# EAGLE design Apollo v1 (EAGLE 7.4.0)
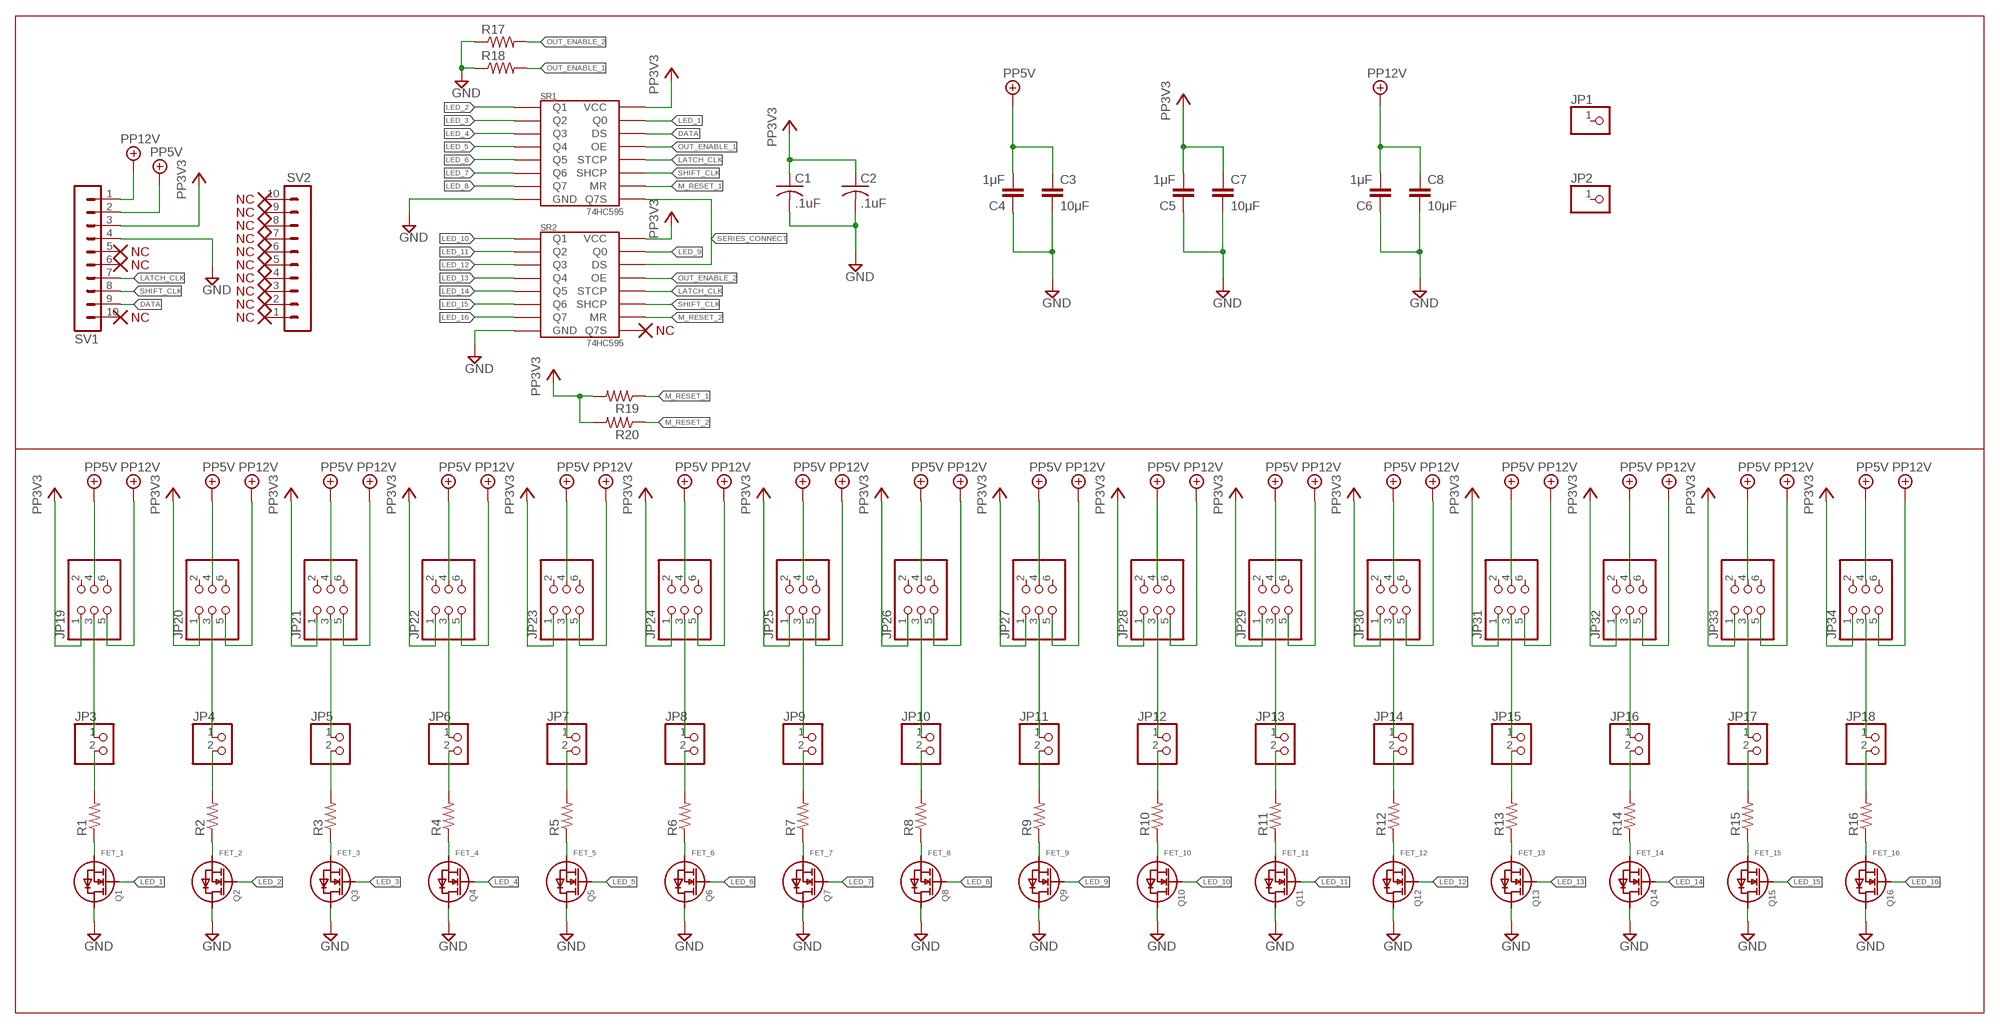
[diagram p0: schematic, sheet 1]

## Parts
C1  .1uF  C-USC0603  [C0603]
C2  .1uF  C-USC0603  [C0603]
C3  10μF  C-EUC1206  [C1206]
C4  1μF  C-EUC0603  [C0603]
C5  1μF  C-EUC0603  [C0603]
C6  1μF  C-EUC0603  [C0603]
C7  10μF  C-EUC1206  [C1206]
C8  10μF  C-EUC1206  [C1206]
JP1  PINHD-1X1  [1X01]
JP2  PINHD-1X1  [1X01]
JP3  PINHD-1X2  [1X02]
JP4  PINHD-1X2  [1X02]
JP5  PINHD-1X2  [1X02]
JP6  PINHD-1X2  [1X02]
JP7  PINHD-1X2  [1X02]
JP8  PINHD-1X2  [1X02]
JP9  PINHD-1X2  [1X02]
JP10  PINHD-1X2  [1X02]
JP11  PINHD-1X2  [1X02]
JP12  PINHD-1X2  [1X02]
JP13  PINHD-1X2  [1X02]
JP14  PINHD-1X2  [1X02]
JP15  PINHD-1X2  [1X02]
JP16  PINHD-1X2  [1X02]
JP17  PINHD-1X2  [1X02]
JP18  PINHD-1X2  [1X02]
JP19  PINHD-2X3  [2X03]
JP20  PINHD-2X3  [2X03]
JP21  PINHD-2X3  [2X03]
JP22  PINHD-2X3  [2X03]
JP23  PINHD-2X3  [2X03]
JP24  PINHD-2X3  [2X03]
JP25  PINHD-2X3  [2X03]
JP26  PINHD-2X3  [2X03]
JP27  PINHD-2X3  [2X03]
JP28  PINHD-2X3  [2X03]
JP29  PINHD-2X3  [2X03]
JP30  PINHD-2X3  [2X03]
JP31  PINHD-2X3  [2X03]
JP32  PINHD-2X3  [2X03]
JP33  PINHD-2X3  [2X03]
JP34  PINHD-2X3  [2X03]
Q1  DMN6140L-7  [SOT-23-3]
Q2  DMN6140L-7  [SOT-23-3]
Q3  DMN6140L-7  [SOT-23-3]
Q4  DMN6140L-7  [SOT-23-3]
Q5  DMN6140L-7  [SOT-23-3]
Q6  DMN6140L-7  [SOT-23-3]
Q7  DMN6140L-7  [SOT-23-3]
Q8  DMN6140L-7  [SOT-23-3]
Q9  DMN6140L-7  [SOT-23-3]
Q10  DMN6140L-7  [SOT-23-3]
Q11  DMN6140L-7  [SOT-23-3]
Q12  DMN6140L-7  [SOT-23-3]
Q13  DMN6140L-7  [SOT-23-3]
Q14  DMN6140L-7  [SOT-23-3]
Q15  DMN6140L-7  [SOT-23-3]
Q16  DMN6140L-7  [SOT-23-3]
R1  R-US_R1206  [R1206]
R2  R-US_R1206  [R1206]
R3  R-US_R1206  [R1206]
R4  R-US_R1206  [R1206]
R5  R-US_R1206  [R1206]
R6  R-US_R1206  [R1206]
R7  R-US_R1206  [R1206]
R8  R-US_R1206  [R1206]
R9  R-US_R1206  [R1206]
R10  R-US_R1206  [R1206]
R11  R-US_R1206  [R1206]
R12  R-US_R1206  [R1206]
R13  R-US_R1206  [R1206]
R14  R-US_R1206  [R1206]
R15  R-US_R1206  [R1206]
R16  R-US_R1206  [R1206]
R17  R-US_R1206  [R1206]
R18  R-US_R1206  [R1206]
R19  R-US_R1206  [R1206]
R20  R-US_R1206  [R1206]
SR1  74HC595  [SO-16]
SR2  74HC595  [SO-16]
SV1  MA10-1  [MA10-1]
SV2  MA10-1  [MA10-1]

## Nets
DATA: SR1.P$14(DS) SV1.9
FET_1: Q1.P$2(S) R1.1
FET_2: Q2.P$2(S) R2.1
FET_3: Q3.P$2(S) R3.1
FET_4: Q4.P$2(S) R4.1
FET_5: Q5.P$2(S) R5.1
FET_6: Q6.P$2(S) R6.1
FET_7: Q7.P$2(S) R7.1
FET_8: Q8.P$2(S) R8.1
FET_9: Q9.P$2(S) R9.1
FET_10: Q10.P$2(S) R10.1
FET_11: Q11.P$2(S) R11.1
FET_12: Q12.P$2(S) R12.1
FET_13: Q13.P$2(S) R13.1
FET_14: Q14.P$2(S) R14.1
FET_15: Q15.P$2(S) R15.1
FET_16: Q16.P$2(S) R16.1
GND: C1.2 C2.2 C3.2 C4.1 C5.1 C6.1 C7.2 C8.2 Q1.P$3(D) Q2.P$3(D) Q3.P$3(D) Q4.P$3(D) Q5.P$3(D) Q6.P$3(D) Q7.P$3(D) Q8.P$3(D) Q9.P$3(D) Q10.P$3(D) Q11.P$3(D) Q12.P$3(D) Q13.P$3(D) Q14.P$3(D) Q15.P$3(D) Q16.P$3(D) R17.1 R18.1 SR1.P$8(GND) SR2.P$8(GND) SV1.4
LATCH_CLK: SR1.P$12(STCP) SR2.P$12(STCP) SV1.7
LED_1: Q1.P$1(G) SR1.P$15(Q0)
LED_2: Q2.P$1(G) SR1.P$1(Q1)
LED_3: Q3.P$1(G) SR1.P$2(Q2)
LED_4: Q4.P$1(G) SR1.P$3(Q3)
LED_5: Q5.P$1(G) SR1.P$4(Q4)
LED_6: Q6.P$1(G) SR1.P$5(Q5)
LED_7: Q7.P$1(G) SR1.P$6(Q6)
LED_8: Q8.P$1(G) SR1.P$7(Q7)
LED_9: Q9.P$1(G) SR2.P$15(Q0)
LED_10: Q10.P$1(G) SR2.P$1(Q1)
LED_11: Q11.P$1(G) SR2.P$2(Q2)
LED_12: Q12.P$1(G) SR2.P$3(Q3)
LED_13: Q13.P$1(G) SR2.P$4(Q4)
LED_14: Q14.P$1(G) SR2.P$5(Q5)
LED_15: Q15.P$1(G) SR2.P$6(Q6)
LED_16: Q16.P$1(G) SR2.P$7(Q7)
M_RESET_1: R19.1 SR1.P$10(MR)
M_RESET_2: R20.1 SR2.P$10(MR)
N$1: JP3.2 R1.2
N$2: JP4.2 R2.2
N$3: JP5.2 R3.2
N$4: JP6.2 R4.2
N$5: JP7.2 R5.2
N$6: JP8.2 R6.2
N$7: JP9.2 R7.2
N$8: JP10.2 R8.2
N$9: JP11.2 R9.2
N$10: JP12.2 R10.2
N$11: JP13.2 R11.2
N$12: JP14.2 R12.2
N$13: JP15.2 R13.2
N$14: JP16.2 R14.2
N$15: JP17.2 R15.2
N$16: JP18.2 R16.2
N$18: JP3.1 JP19.3
N$19: JP4.1 JP20.3
N$20: JP5.1 JP21.3
N$21: JP6.1 JP22.3
N$22: JP7.1 JP23.3
N$23: JP8.1 JP24.3
N$24: JP9.1 JP25.3
N$25: JP10.1 JP26.3
N$26: JP11.1 JP27.3
N$27: JP12.1 JP28.3
N$28: JP13.1 JP29.3
N$29: JP14.1 JP30.3
N$30: JP15.1 JP31.3
N$31: JP16.1 JP32.3
N$32: JP17.1 JP33.3
N$33: JP18.1 JP34.3
OUT_ENABLE_1: R18.2 SR1.P$13(OE)
OUT_ENABLE_2: R17.2 SR2.P$13(OE)
PP3V3: C1.1 C2.1 C5.2 C7.1 JP19.1 JP20.1 JP21.1 JP22.1 JP23.1 JP24.1 JP25.1 JP26.1 JP27.1 JP28.1 JP29.1 JP30.1 JP31.1 JP32.1 JP33.1 JP34.1 R19.2 R20.2 SR1.P$16(VCC) SR2.P$16(VCC) SV1.3
PP5V: C3.1 C4.2 JP19.4 JP20.4 JP21.4 JP22.4 JP23.4 JP24.4 JP25.4 JP26.4 JP27.4 JP28.4 JP29.4 JP30.4 JP31.4 JP32.4 JP33.4 JP34.4 SV1.2
PP12V: C6.2 C8.1 JP19.5 JP20.5 JP21.5 JP22.5 JP23.5 JP24.5 JP25.5 JP26.5 JP27.5 JP28.5 JP29.5 JP30.5 JP31.5 JP32.5 JP33.5 JP34.5 SV1.1
SERIES_CONNECT: SR1.P$9(Q7S) SR2.P$14(DS)
SHIFT_CLK: SR1.P$11(SHCP) SR2.P$11(SHCP) SV1.8
Unconnected: JP1.1 JP2.1 JP19.2 JP19.6 JP20.2 JP20.6 JP21.2 JP21.6 JP22.2 JP22.6 JP23.2 JP23.6 JP24.2 JP24.6 JP25.2 JP25.6 JP26.2 JP26.6 JP27.2 JP27.6 JP28.2 JP28.6 JP29.2 JP29.6 JP30.2 JP30.6 JP31.2 JP31.6 JP32.2 JP32.6 JP33.2 JP33.6 JP34.2 JP34.6 SR2.P$9(Q7S) SV1.5 SV1.6 SV1.10 SV2.1 SV2.2 SV2.3 SV2.4 SV2.5 SV2.6 SV2.7 SV2.8 SV2.9 SV2.10

## Library data of the parts
C1 C2 = rcl:C-US: CAPACITOR, American symbol
C3-C8 = rcl:C-EU: CAPACITOR, European symbol
JP1 JP2 = pinhead:PINHD-1X1: PIN HEADER
JP3-JP18 = pinhead:PINHD-1X2: PIN HEADER
JP19-JP34 = pinhead:PINHD-2X3: PIN HEADER
Q1-Q16 = CP-Discrete:DMN6140L-7: NMosfet 60V 1.6A 140mOhm @ 10V 700mW
R1-R20 = rcl:R-US_: RESISTOR, American symbol
SR1 SR2 = CP-IC:74HC595: Real 8 Bit Shift register
SV1 SV2 = con-lstb:MA10-1: PIN HEADER; OC_FARNELL: unknown; OC_NEWARK: unknown

## Board
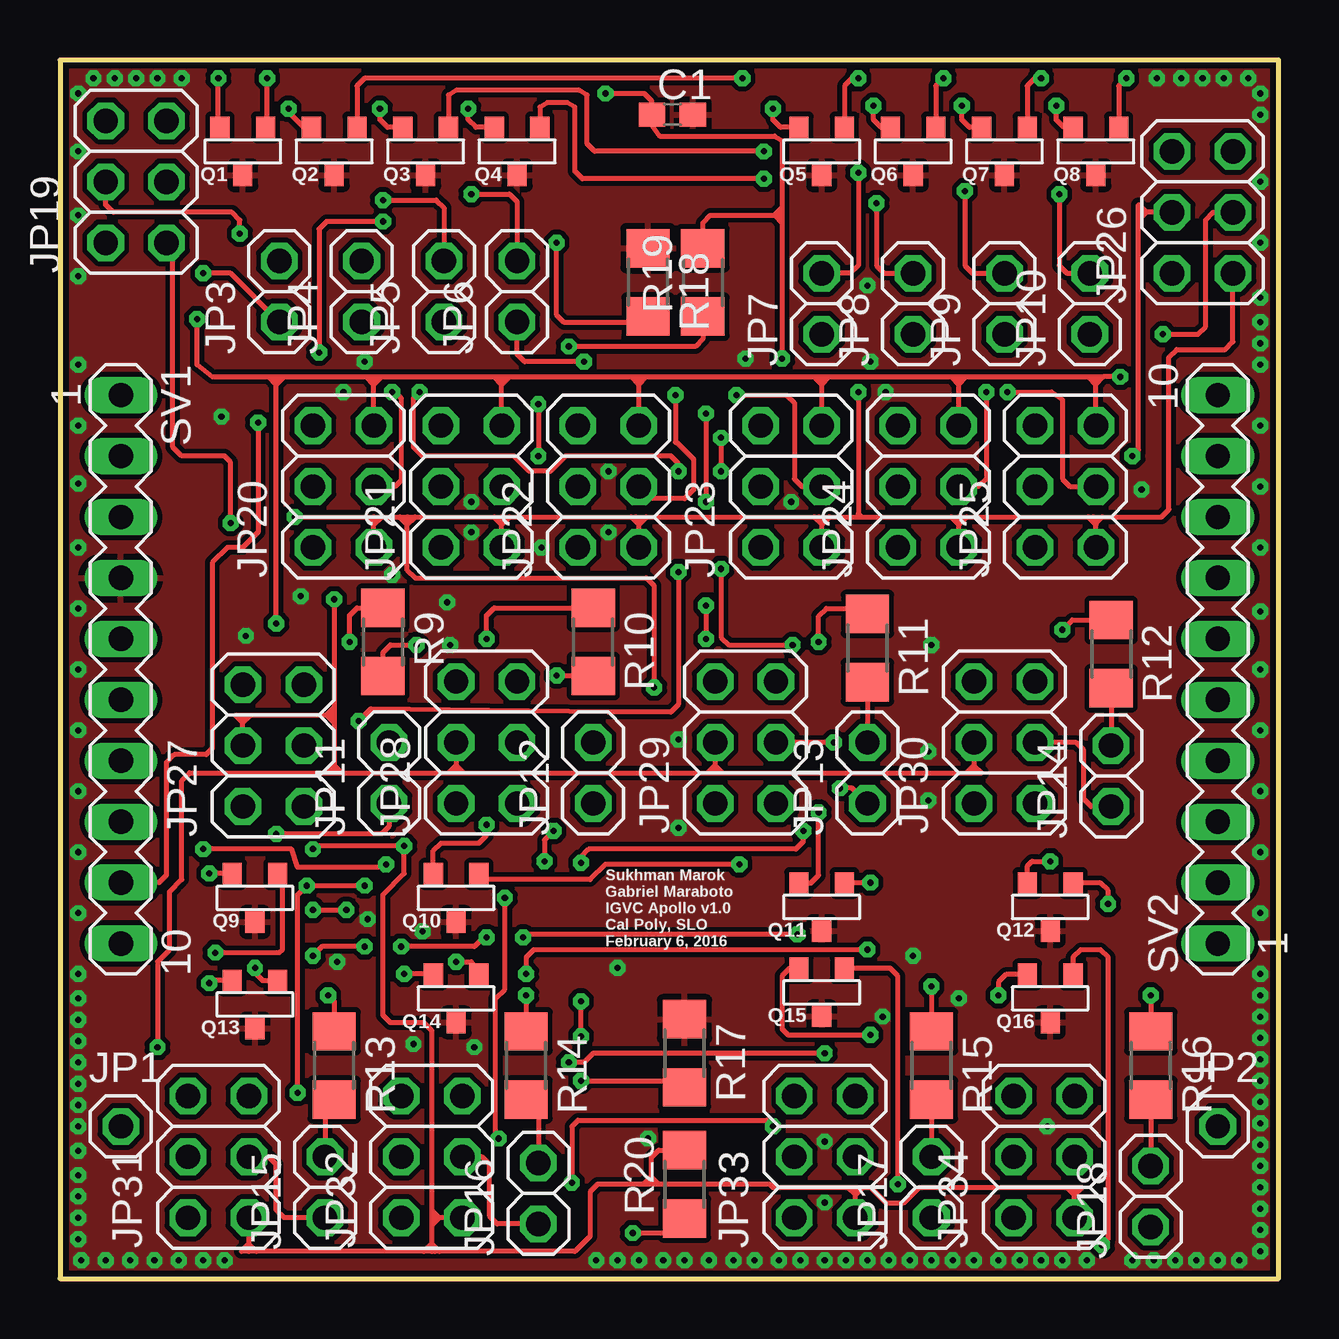
[diagram p1: board, top side]
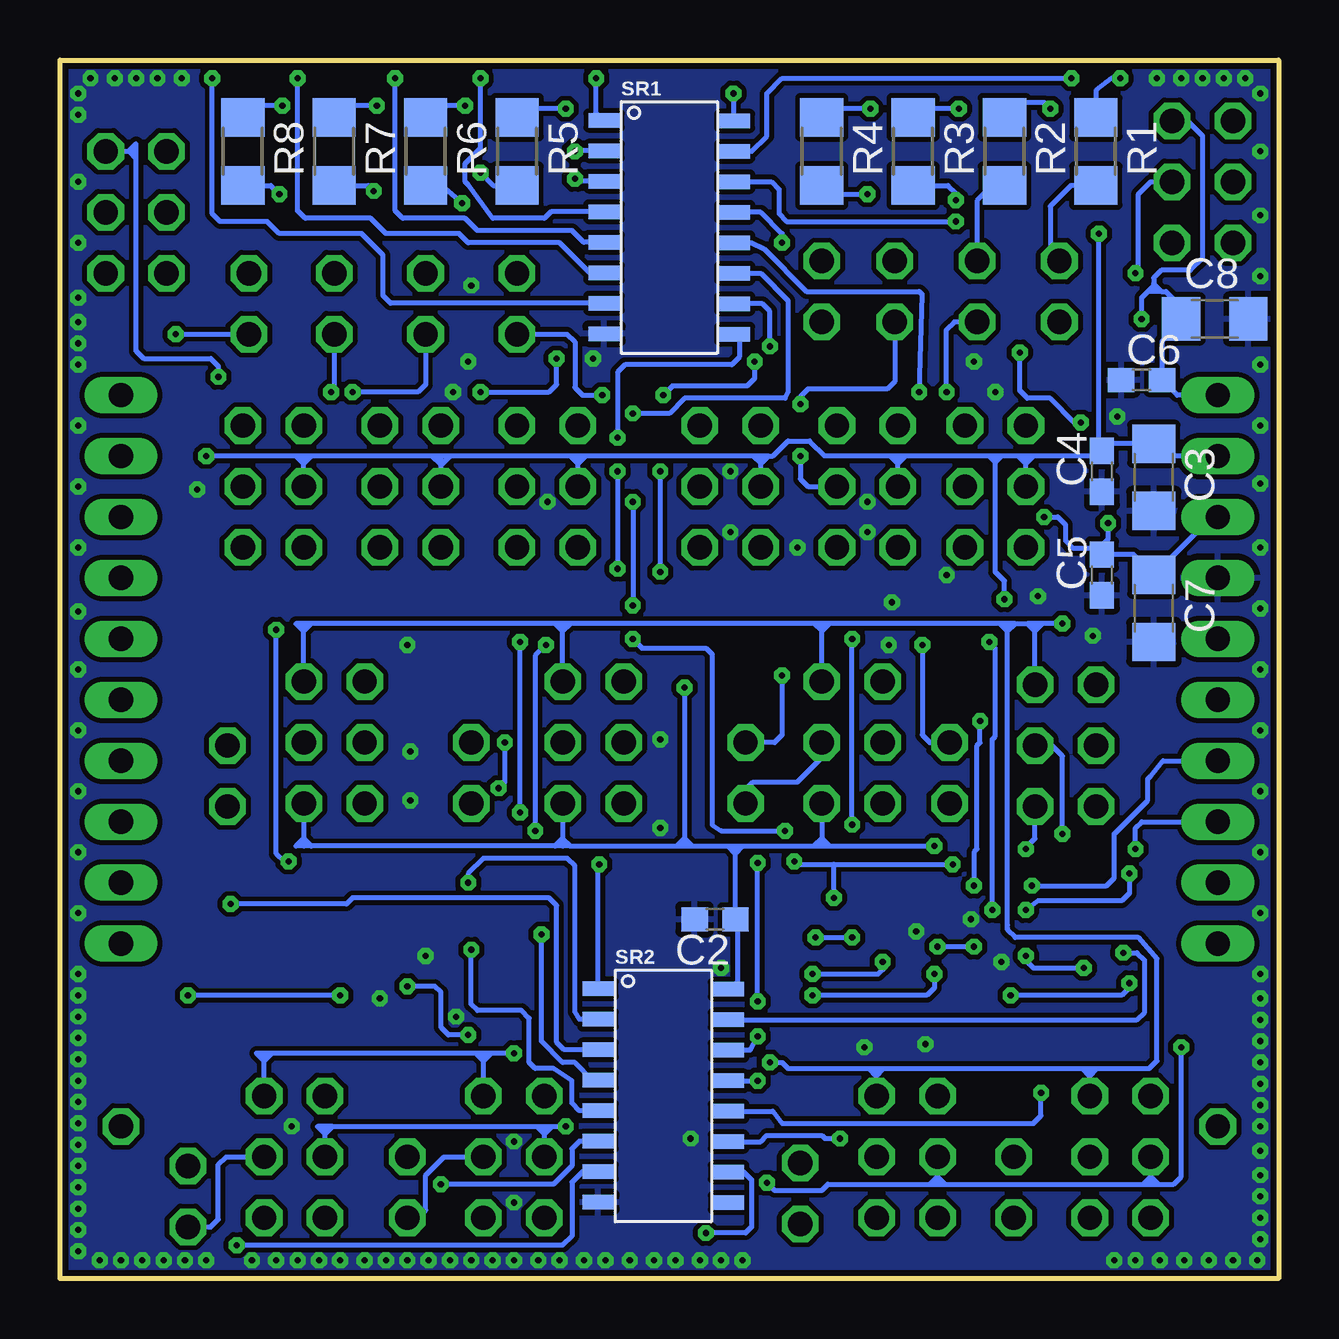
[diagram p2: board, bottom side, seen from below]

Size 50.8 x 50.8 mm. Coordinates in mm from the lower left corner, seen from the top.
Outline: 0,0 50.8,0 50.8,50.8 0,50.8 0,0
Copper layers (1*16): Top 0.035mm / dielectric 1.5mm / Bottom 0.035mm
Design rules "default *": minimum track width 8mil, minimum drill 10mil, track to track 8mil, track to pad 8mil, pad to pad 8mil, via to via 8mil, smd to smd 8mil, copper to edge 10mil, drill to drill 8mil, minimum pad ring 10mil, minimum via ring 8mil, stop-mask expansion 4mil, vias tented up to drill 0mil, thermal gap 10mil

### Footprints (pad centres in the part's own frame; a part is rotated, then mirrored left to right if it is on the bottom)
C0603 = smd 1.1 x 1: 1 -0.85,0; 2 0.85,0
C1206 = smd 1.6 x 1.8: 1 -1.4,0; 2 1.4,0
1X01 = drill 1.016 octagon: 1 0,0
1X02 = drill 1.016 octagon: 1 -1.27,0; 2 1.27,0
2X03 = drill 1.016 octagon: 1 -2.54,-1.27; 2 -2.54,1.27; 3 0,-1.27; 4 0,1.27; 5 2.54,-1.27; 6 2.54,1.27
SOT-23-3 = smd 0.8 x 0.9: P$1 -0.95,-1; P$2 0.95,-1; P$3 0,1
R1206 = smd 1.6 x 1.803: 1 -1.422,0; 2 1.422,0
SO-16 = smd 1.3 x 0.6: P$1 -2.72,4.465; P$2 -2.72,3.195; P$3 -2.72,1.925; P$4 -2.72,0.655; P$5 -2.72,-0.615; P$6 -2.72,-1.885; P$7 -2.72,-3.155; P$8 -2.72,-4.425; P$9 2.72,-4.445; P$10 2.72,-3.175; P$11 2.72,-1.905; P$12 2.72,-0.635; P$13 2.72,0.635; P$14 2.72,1.905; P$15 2.72,3.175; P$16 2.72,4.445
MA10-1 = drill 1.016 long: 1 -11.43,0; 2 -8.89,0; 3 -6.35,0; 4 -3.81,0; 5 -1.27,0; 6 1.27,0; 7 3.81,0; 8 6.35,0; 9 8.89,0; 10 11.43,0

### Placement (x,y rotation side)
C1  25.53,48.51 0 top
C2  23.5,14.99 180 bottom
C3  5.21,33.4 270 bottom
C4  7.37,33.66 90 bottom
C5  7.37,29.34 90 bottom
C6  5.71,37.47 0 bottom
C7  5.21,27.94 270 bottom
C8  2.67,40.01 0 bottom
JP1  2.54,6.35 0 top
JP2  48.26,6.35 0 top
JP3  9.14,41.15 90 top
JP4  12.57,41.15 90 top
JP5  16,41.15 90 top
JP6  19.05,41.15 90 top
JP7  31.75,40.64 90 top
JP8  35.56,40.64 90 top
JP9  39.37,40.64 90 top
JP10  42.93,40.64 90 top
JP11  13.72,21.08 90 top
JP12  22.23,21.08 90 top
JP13  33.66,21.08 90 top
JP14  43.81,20.95 90 top
JP15  11.05,3.81 90 top
JP16  19.94,3.56 90 top
JP17  36.32,3.81 90 top
JP18  45.47,3.43 90 top
JP19  3.17,45.72 90 top
JP20  11.81,33.02 90 top
JP21  17.14,33.02 90 top
JP22  22.86,33.02 90 top
JP23  30.48,33.02 90 top
JP24  36.2,33.02 90 top
JP25  41.91,33.02 90 top
JP26  47.62,44.45 90 top
JP27  8.89,22.23 90 top
JP28  17.78,22.35 90 top
JP29  28.57,22.35 90 top
JP30  39.37,22.35 90 top
JP31  6.6,5.08 90 top
JP32  15.49,5.08 90 top
JP33  31.88,5.08 90 top
JP34  41.02,5.08 90 top
Q1  7.62,46.99 180 top
Q2  11.43,46.99 180 top
Q3  15.24,46.99 180 top
Q4  19.05,46.99 180 top
Q5  31.75,46.99 180 top
Q6  35.56,46.99 180 top
Q7  39.37,46.99 180 top
Q8  43.18,46.99 180 top
Q9  8.13,15.88 180 top
Q10  16.51,15.88 180 top
Q11  31.75,15.49 180 top
Q12  41.27,15.49 180 top
Q13  8.13,11.43 180 top
Q14  16.51,11.68 180 top
Q15  31.75,11.94 180 top
Q16  41.27,11.68 180 top
R1  7.62,46.99 270 bottom
R2  11.43,46.99 270 bottom
R3  15.24,46.99 270 bottom
R4  19.05,46.99 270 bottom
R5  31.75,46.99 270 bottom
R6  35.56,46.99 270 bottom
R7  39.37,46.99 270 bottom
R8  43.18,46.99 270 bottom
R9  13.46,26.54 270 top
R10  22.23,26.54 270 top
R11  33.66,26.29 270 top
R12  43.81,26.04 270 top
R13  11.43,8.89 270 top
R14  19.43,8.89 270 top
R15  36.32,8.89 270 top
R16  45.47,8.89 270 top
R17  26.04,9.4 270 top
R18  24.51,41.53 270 top
R19  26.8,41.53 90 top
R20  26.04,3.94 90 top
SR1  25.4,43.81 0 bottom
SR2  25.65,7.62 0 bottom
SV1  2.54,25.4 270 top
SV2  48.26,25.4 90 top

### Tracks (layer width: path | path; a pad name or v marks a point on that pad's centre or on a via)
DATA  (via drill 0.25)
  Top 0.203: v8.26,35.69 8.26,31.11 7.62,30.48 6.99,30.48 6.35,29.84 6.35,22.1 6.1,21.84 4.76,21.84 4.45,21.53 4.45,16.83 4.13,16.51 SV1.9 | v10.79,38.61 10.79,43.75 11.11,44.07 v13.46,44.07
  Bottom 0.203: v8.26,35.69 8.51,35.69 9.53,36.7 10.48,36.7 10.79,37.02 v10.79,38.61 | SR1.P$14 21.14,45.72 20.83,45.4 20.83,44.39 20.51,44.07 v13.46,44.07
FET_1  (via drill 0.25)
  Top 0.203: Q1.P$2 6.6,48.06 v6.6,50.04
  Bottom 0.203: v6.6,50.04 6.99,50.04 7.62,49.53 R1.1
FET_2  (via drill 0.25)
  Top 0.203: Q2.P$2 10.16,47.99 9.53,48.62 v9.53,48.77
  Bottom 0.203: v9.53,48.77 9.78,49.02 11.11,49.02 11.43,48.7 R2.1
FET_3  (via drill 0.25)
  Top 0.203: Q3.P$2 13.65,47.99 13.34,48.31 v13.34,48.77
  Bottom 0.203: v13.34,48.77 14.92,48.77 15.24,48.45 R3.1
FET_4  (via drill 0.25)
  Top 0.203: Q4.P$2 17.34,47.99 17.02,48.31 v17.02,48.77
  Bottom 0.203: 18.82,48.64 R4.1 | 19.15,48.51 R4.1 | v17.02,48.77 18.69,48.77 R4.1
FET_5  (via drill 0.25)
  Top 0.203: Q5.P$2 30.04,47.99 29.72,48.31 v29.72,48.77
  Bottom 0.203: v29.72,48.77 31.43,48.77 31.75,48.45 R5.1
FET_6  (via drill 0.25)
  Top 0.203: Q6.P$2 34.23,47.99 33.91,48.31 v33.91,48.9
  Bottom 0.203: v33.91,48.9 35.24,48.9 35.56,48.58 R6.1
FET_7  (via drill 0.25)
  Top 0.203: Q7.P$2 37.91,47.99 37.59,48.31 v37.59,48.9
  Bottom 0.203: 39.14,48.64 R7.1 39.37,48.58 39.05,48.9 v37.59,48.9
FET_8  (via drill 0.25)
  Top 0.203: Q8.P$2 41.85,47.99 41.53,48.31 v41.53,48.9
  Bottom 0.203: 42.95,48.64 R8.1 43.18,48.58 42.86,48.9 v41.53,48.9
FET_9  (via drill 0.25)
  Top 0.203: Q9.P$2 7.16,16.89 v6.22,16.89 | v10.54,15.37 v11.94,15.37 | v12.06,26.54 12.06,27.65 12.38,27.96 R9.1
  Bottom 0.203: v6.22,16.89 6.22,16.07 6.54,15.75 10.03,15.75 v10.54,15.37 | v11.94,15.37 11.94,22.48 11.81,22.61 11.81,26.29 v12.06,26.54
FET_10  (via drill 0.25)
  Top 0.203: R10.1 18.1,27.96 17.78,27.65 v17.78,26.67 | Q10.P$2 15.56,17.84 15.88,18.16 17.46,18.16 17.78,18.48 v17.78,18.92
  Bottom 0.203: v17.78,18.92 v17.78,26.67
FET_11  (via drill 0.25)
  Top 0.203: Q11.P$2 31.3,16.49 31.62,16.81 v31.62,19.43 | v31.62,26.54 31.62,27.62 31.94,27.94 33.43,27.94 R11.1
  Bottom 0.203: v31.62,19.43 v31.62,26.54
FET_12  (via drill 0.25)
  Top 0.203: Q12.P$2 40.33,17.21 40.52,17.4 v41.27,17.4 | v41.78,27.05 42.19,27.46 R12.1
  Bottom 0.203: v41.78,27.05 41.78,17.72 41.47,17.4 v41.27,17.4
FET_13  (via drill 0.25)
  Top 0.203: Q13.P$2 6.33,12.43 v6.22,12.32 | v11.18,11.81 11.43,11.56 R13.1
  Bottom 0.203: v6.22,12.32 6.22,12.13 6.54,11.81 v11.18,11.81
FET_14  (via drill 0.25)
  Top 0.203: Q14.P$2 15.54,12.7 v14.35,12.7 | v19.43,11.81 R14.1
  Bottom 0.203: v14.35,12.7 14.35,12.13 14.67,11.81 v19.43,11.81
FET_15  (via drill 0.25)
  Top 0.203: Q15.P$2 30.42,12.94 30.1,12.62 30.1,10.41 30.35,10.16 v33.78,10.16 | v36.32,12.19 R15.1
  Bottom 0.203: v33.78,10.16 34.61,10.16 34.92,10.48 34.92,11.94 35.18,12.19 v36.32,12.19
FET_16  (via drill 0.25)
  Top 0.203: Q16.P$2 39.43,12.68 39.12,12.37 v39.12,11.81 | v45.47,11.81 R16.1
  Bottom 0.203: v39.12,11.81 v45.47,11.81
GND  (via drill 0.25)
  other vias: 10.03,28.45 6.73,35.94 11.81,36.96 17.14,32.38 15.11,14.48 17.27,9.65 12.83,14.99 11.56,13.21 14.73,9.78 23.24,12.95 35.56,13.46 37.47,11.68 31.88,5.71 31.88,3.17 41.15,6.35 24.51,5.84 16.26,26.42 25.78,18.8 25.78,22.48 17.14,31.11 28.57,38.35 33.78,38.23 34.42,36.96 30.48,32.38 22.86,33.66 22.86,31.11 33.66,41.4 45.09,32.89 36.32,26.42 36.2,21.97 36.2,19.94 12.7,38.23 20.07,30.48 16.13,28.19 7.75,26.8 13.84,29.34 34.29,10.92 45.72,50.04 46.74,50.04 47.62,50.04 48.51,50.04 49.53,50.04 50.04,49.4 50.04,48.51 50.04,45.72 50.04,43.18 50.04,40.89 50.04,39.88 50.04,38.99 50.04,38.1 50.04,35.56 50.04,33.02 50.04,30.48 50.04,27.81 50.04,25.4 50.04,22.86 50.04,20.32 50.04,17.78 50.04,15.24 50.04,12.7 50.04,11.81 50.04,10.92 50.04,10.03 50.04,9.14 50.04,8.26 50.04,7.37 50.04,6.48 50.04,5.59 50.04,4.7 50.04,3.81 50.04,2.92 50.04,2.03 50.04,1.14 49.15,0.76 48.26,0.76 47.37,0.76 46.48,0.76 45.59,0.76 44.7,0.76 42.8,0.76 41.78,0.76 40.89,0.76 40.01,0.76 39.12,0.76 38.1,0.76 37.21,0.76 36.32,0.76 35.43,0.76 34.54,0.76 33.66,0.76 32.77,0.76 31.88,0.76 30.86,0.76 29.97,0.76 28.96,0.76 28.07,0.76 27.05,0.76 26.04,0.76 25.15,0.76 24.13,0.76 23.24,0.76 22.35,0.76 6.86,0.76 5.97,0.76 4.95,0.76 3.94,0.76 2.92,0.76 1.91,0.76 0.89,0.76 0.76,1.65 0.76,2.54 0.76,3.43 0.76,4.32 0.76,5.33 0.76,6.35 0.76,7.24 0.76,8.13 0.76,9.02 0.76,9.91 0.76,10.79 0.76,11.68 0.76,12.7 0.76,15.24 0.76,17.78 0.76,20.32 0.76,22.86 0.76,25.4 0.76,27.94 0.76,30.48 0.76,33.15 0.76,35.56 0.76,38.1 0.76,41.78 0.76,44.32 0.76,46.99 0.76,49.4 1.4,50.04 2.29,50.04 3.17,50.04 4.06,50.04 5.08,50.04
  pour Bottom: 0.25,50.55 0.25,0.25 50.55,0.25 50.55,50.55
  pour Top: 0.25,50.55 0.25,0.25 50.55,0.25 50.55,50.55
LATCH_CLK  (via drill 0.25)
  Top 0.203: v25.78,29.46 25.78,23.94 25.46,23.62 22.86,23.62 12.95,23.75 v12.45,23.24 | v12.7,16.38 v10.29,16.38 9.91,16 v9.91,7.75 | v14.99,36.96 14.73,36.7 14.73,34.67 15.11,34.29 18.92,34.29 19.56,33.66 20.45,33.66 21.08,34.29 25.46,34.29 25.78,33.97 v25.78,33.66
  Bottom 0.203: SR1.P$12 21.97,43.18 21.46,42.93 19.68,41.15 14.99,41.15 14.86,41.02 v14.99,36.96 | v25.78,33.66 v25.78,29.46 | SV1.7 4.83,21.59 5.33,20.95 5.46,20.83 5.46,19.94 6.86,18.54 6.86,16.7 7.18,16.38 v10.29,16.38 | SR2.P$12 21.08,6.99 20.7,6.48 10.22,6.48 9.91,6.79 v9.91,7.75 | v12.45,23.24 12.45,22.35 12.57,22.23 12.57,17.91 12.7,17.78 v12.7,16.38
LED_1  (via drill 0.25)
  Top 0.203: Q1.P$1 8.64,48.06 v8.64,50.04
  Bottom 0.203: SR1.P$15 21.97,46.99 21.34,47.62 21.34,49.4 20.7,50.04 v8.64,50.04
LED_2  (via drill 0.25)
  Top 0.203: v28.45,50.04 12.7,50.04 12.38,49.72 Q2.P$1
  Bottom 0.203: SR1.P$1 28.45,48.6 v28.45,50.04
LED_3  (via drill 0.25)
  Top 0.203: v29.34,46.99 22.29,46.99 21.97,47.31 21.97,49.34 21.65,49.53 16.51,49.53 16.19,49.34 Q3.P$1
  Bottom 0.203: SR1.P$2 29.32,47.01 v29.34,46.99
LED_4  (via drill 0.25)
  Top 0.203: v29.34,45.85 21.78,45.85 21.46,46.16 21.46,48.83 21.14,49.02 20.32,49.02 20,48.83 Q4.P$1
  Bottom 0.203: SR1.P$3 29.23,45.74 v29.34,45.85
LED_5  (via drill 0.25)
  Top 0.203: v33.27,50.04 33.02,50.04 32.7,49.72 Q5.P$1
  Bottom 0.203: SR1.P$4 30.33,44.47 30.61,44.2 32.77,44.2 33.78,45.59 33.91,45.72 33.91,46.48 33.27,47.12 v33.27,50.04
LED_6  (via drill 0.25)
  Top 0.203: v36.83,50.04 36.51,49.72 Q6.P$1
  Bottom 0.203: SR1.P$5 28.98,43.2 29.46,43.69 33.4,43.69 33.91,44.2 36.51,44.2 36.83,44.51 v36.83,50.04
LED_7  (via drill 0.25)
  Top 0.203: v40.89,50.04 40.64,50.04 40.32,49.72 Q7.P$1
  Bottom 0.203: SR1.P$6 28.72,41.93 29.97,43.18 33.78,43.18 34.16,43.56 37.21,43.56 37.85,44.2 40.58,44.2 40.89,44.51 v40.89,50.04
LED_8  (via drill 0.25)
  Top 0.203: v44.45,50.04 44.13,49.72 Q8.P$1
  Bottom 0.203: SR1.P$7 37.02,40.66 37.34,40.98 37.34,42.67 38.23,43.56 41.66,43.56 42.16,44.07 44.13,44.07 44.45,44.39 v44.45,50.04
LED_9  (via drill 0.25)
  Top 0.203: Q9.P$1 9.27,16.68 9.27,13.72 9.14,13.59 v6.48,13.59
  Bottom 0.203: SR2.P$15 5.91,10.79 5.59,11.11 5.59,13.27 5.91,13.59 v6.48,13.59
LED_10  (via drill 0.25)
  Top 0.203: v28.32,17.27 22.73,17.27 22.1,16.64 17.7,16.64 Q10.P$1 17.57,16.76
  Bottom 0.203: SR2.P$1 28.37,17.35 v28.32,17.27
LED_11  (via drill 0.25)
  Top 0.203: v33.78,16.51 33.77,16.49 Q11.P$1
  Bottom 0.203: SR2.P$2 29.15,10.81 29.34,11.13 29.34,17.21 29.65,17.53 33.15,17.53 33.78,16.89 v33.78,16.51
LED_12  (via drill 0.25)
  Top 0.203: v43.69,15.62 43.69,16.18 43.37,16.49 Q12.P$1
  Bottom 0.203: SR2.P$3 29.78,9.54 30.1,9.86 30.1,15.56 30.42,15.88 38.61,15.88 38.86,15.62 v43.69,15.62
LED_13  (via drill 0.25)
  Top 0.203: v17.78,14.22 17.65,14.22 17.27,13.84 v14.22,13.84 | v12.7,13.84 10.92,13.84 v10.54,13.46 | v8.13,12.95 8.13,12.75 8.45,12.43 Q13.P$1 | v30.73,14.35 19.43,14.35 v19.3,14.22
  Bottom 0.203: v30.73,14.35 30.73,9.91 29.84,9.02 29.34,9.02 28.59,8.28 SR2.P$4 | v19.3,14.22 v17.78,14.22 | v14.22,13.84 v12.7,13.84 | v10.54,13.46 10.54,13.27 10.22,12.95 v8.13,12.95
LED_14  (via drill 0.25)
  Top 0.203: v33.66,13.72 19.75,13.72 19.43,13.4 v19.43,12.7 | v16.51,13.21 17.14,13.21 17.46,12.89 Q14.P$1
  Bottom 0.203: SR2.P$5 29.15,7 29.46,7.32 29.46,8.26 30.23,8.76 30.99,8.76 31.24,9.02 31.24,10.86 31.56,11.18 33.4,11.18 33.66,11.43 v33.66,13.72 | v19.43,12.7 16.7,12.7 16.38,13.02 v16.51,13.21
LED_15  (via drill 0.25)
  Top 0.203: Q15.P$1 34.61,12.94 34.92,12.62 v34.92,3.94
  Bottom 0.203: SR2.P$6 29.15,5.74 29.46,5.42 29.46,4.7 30.23,3.94 v34.92,3.94
LED_16  (via drill 0.25)
  Top 0.203: v43.43,1.4 43.69,1.65 43.69,13.4 43.37,13.72 42.54,13.72 42.23,13.4 Q16.P$1
  Bottom 0.203: SR2.P$7 29.02,4.46 29.46,4.02 29.46,1.78 29.84,1.4 v43.43,1.4
M_RESET_1  (via drill 0.25)
  Top 0.203: R19.1 26.8,39.18 26.48,38.86 v21.21,38.86
  Bottom 0.203: SR1.P$10 21.53,40.64 21.21,40.32 v21.21,38.86
M_RESET_2  (via drill 0.25)
  Top 0.203: v23.88,1.91 25.72,1.91 26.04,2.22 R20.1
  Bottom 0.203: SR2.P$10 22.29,4.45 21.97,4.13 21.97,2.16 22.23,1.91 v23.88,1.91
N$1
  Bottom 0.203: R1.2 8.66,45.57 9.53,44.7 9.53,42.8 JP3.2
N$2
  Bottom 0.203: R2.2 11.94,45.57 12.57,44.93 JP4.2
N$3  (via drill 0.25)
  Top 0.203: v13.46,44.96 15.68,44.96 16,44.64 JP5.2
  Bottom 0.203: R3.2 13.78,45.57 13.46,45.25 v13.46,44.96
N$4  (via drill 0.25)
  Top 0.203: v17.14,45.21 18.73,45.21 19.05,44.9 JP6.2
  Bottom 0.203: R4.2 18.69,45.21 v17.14,45.21
N$5  (via drill 0.25)
  Top 0.203: v33.27,46.1 33.27,42.23 32.96,41.91 JP7.2
  Bottom 0.203: v33.27,46.1 32.74,45.57 R5.2
N$6  (via drill 0.25)
  Top 0.203: v34.04,44.83 34.04,42.23 34.35,41.91 JP8.2
  Bottom 0.203: 34.9,45.57 34.77,45.57 | v34.04,44.83 34.9,45.57 | 34.9,45.57 R6.2
N$7  (via drill 0.25)
  Top 0.203: v37.72,45.34 37.72,42.23 38.04,41.91 JP9.2
  Bottom 0.203: R7.2 37.95,45.57 v37.72,45.34
N$8  (via drill 0.25)
  Top 0.203: v41.66,45.21 41.66,42.23 41.97,41.91 JP10.2
  Bottom 0.203: R8.2 42.01,45.57 v41.66,45.21
N$9  (via drill 0.25)
  Top 0.203: R9.2 13.46,26.1 13.78,26.42 v14.86,26.42
  Bottom 0.203: v14.86,26.42 14.86,22.67 14.54,22.35 JP11.2
N$10  (via drill 0.25)
  Top 0.203: R10.2 20.73,25.12 v20.7,25.15
  Bottom 0.203: v20.7,25.15 20.7,22.67 21.02,22.35 JP12.2
N$11
  Top 0.203: R11.2 JP13.2
N$12
  Top 0.203: R12.2 JP14.2
N$13
  Top 0.203: R13.2 11.37,7.47 11.05,7.15 JP15.2
N$14
  Top 0.203: R14.2 19.62,7.47 19.94,7.15 JP16.2
N$15
  Top 0.203: R15.2 JP17.2
N$16
  Top 0.203: R16.2 JP18.2
N$18  (via drill 0.25)
  Top 0.203: JP3.1 7.11,41.91 v5.97,41.91
  Bottom 0.203: JP19.3 5.33,45.72 5.84,45.21 5.84,42.04 v5.97,41.91
N$19  (via drill 0.25)
  Top 0.203: JP20.3 13.97,33.02 14.22,33.27 14.22,36.7 13.97,36.96 v13.84,36.96
  Bottom 0.203: JP4.1 13.53,39.88 13.84,39.56 v13.84,36.96
N$20  (via drill 0.25)
  Top 0.203: v19.94,36.45 v19.94,34.29
  Bottom 0.203: JP5.1 16,37.4 16.32,37.08 19.62,37.08 19.94,36.77 v19.94,36.45 | JP21.3 19.62,33.02 19.94,33.34 v19.94,34.29
N$21  (via drill 0.25)
  Top 0.203: v21.84,38.23 19.37,38.23 19.05,38.54 JP6.1 | v25.65,36.83 25.65,34.86 25.72,34.86 26.42,34.16 26.42,32.89 26.04,32.51 24.45,32.51 24.13,32.83 JP22.3
  Bottom 0.203: v21.84,38.23 21.84,37.53 22.16,37.21 25.27,37.21 v25.65,36.83
N$22  (via drill 0.25)
  Top 0.203: v28.19,36.83 30.29,36.83 30.61,36.51 30.61,33.34 30.92,33.02 JP23.3
  Bottom 0.203: JP7.1 29.65,39.37 29.34,39.05 29.34,37.15 29.02,36.83 v28.19,36.83
N$23  (via drill 0.25)
  Top 0.203: JP24.3 38.29,33.02 38.61,33.34 v38.61,36.96
  Bottom 0.203: JP8.1 35.56,37.27 35.88,36.96 v38.61,36.96
N$24  (via drill 0.25)
  Top 0.203: v39.5,36.96 41.34,36.96 41.78,36.64 41.78,33.34 42.1,33.02 JP25.3
  Bottom 0.203: JP9.1 39.37,37.08 v39.5,36.96
N$25  (via drill 0.25)
  Top 0.203: JP26.3 48.07,44.45 47.75,44.13 47.75,39.69 47.43,39.37 v45.97,39.37
  Bottom 0.203: v45.97,39.37 JP10.1
N$26  (via drill 0.25)
  Top 0.203: JP11.1 13.72,18.86 13.4,18.54 v9.02,18.54
  Bottom 0.203: JP27.3 9.46,22.23 9.02,21.78 v9.02,18.54
N$27
  Bottom 0.203: JP12.1 22.23,20.38 21.91,20.7 20.07,20.7 19.05,21.72 JP28.3
N$28  (via drill 0.25)
  Top 0.203: v32.26,22.35 JP29.3 | JP13.1 33.02,20.45 v32.51,20.45
  Bottom 0.203: v32.51,20.45 32.26,20.7 v32.26,22.35
N$29
  Top 0.203: JP14.1 42.99,19.68 42.67,20 42.67,22.04 42.35,22.35 JP30.3
N$30
  Top 0.203: JP15.1 9.34,2.54 9.02,2.86 9.02,4.76 8.7,5.08 JP31.3
N$31
  Top 0.203: JP16.1 18.22,2.29 17.91,2.6 17.91,4.76 17.59,5.08 JP32.3
N$32
  Bottom 0.203: JP17.1 35.88,2.54 35.56,2.86 35.56,4.32 34.8,5.08 JP33.3
N$33
  Bottom 0.203: JP18.1 44.51,2.16 44.2,2.48 44.2,4.76 43.88,5.08 JP34.3
OUT_ENABLE_1  (via drill 0.25)
  Top 0.203: v20.7,43.18 20.7,40.17 21.02,39.85 24.26,39.85 R18.2
  Bottom 0.203: v20.7,43.18 20.7,43.56 21.59,44.45 SR1.P$13
OUT_ENABLE_2  (via drill 0.25)
  Top 0.203: v21.72,8.26 25.76,8.26 R17.2
  Bottom 0.203: SR2.P$13 v21.72,8.26
PP3V3  (via drill 0.25)
  Top 0.203: 12.76,31.75 13.08,31.75 | 13.08,31.75 13.4,31.75 | 13.4,31.75 14.16,31.75 | 14.16,31.75 14.48,31.75 | 14.48,31.75 14.8,31.75 | 14.8,31.75 18.1,31.75 | 18.1,31.75 18.41,31.75 | 18.41,31.75 18.73,31.75 | 18.73,31.75 23.81,31.75 | 23.81,31.75 24,31.75 | 24,31.75 24.45,31.75 | 31.43,31.75 31.62,31.75 | 31.62,31.75 32.07,31.75 | 32.07,31.75 33.4,31.75 | 33.4,31.75 37.15,31.75 | 37.15,31.75 37.47,31.75 | 37.47,31.75 37.78,31.75 | 37.78,31.75 42.86,31.75 | 42.86,31.75 43.05,31.75 | 43.05,31.75 43.43,31.75 | v24.77,24.64 24.77,28.89 24.45,29.21 14.8,29.21 14.48,29.53 14.48,31.75 | 32.83,3.81 29.72,3.81 29.59,3.94 24.96,3.94 | 32.83,3.81 33.02,3.81 | 33.02,3.81 33.47,3.81 | 41.97,3.81 42.42,3.81 | 42.42,3.81 42.61,3.81 42.29,3.49 41.97,3.81 | JP19.1 4.7,42.93 4.7,34.67 5.08,34.29 6.86,34.29 7.11,34.04 v7.11,31.5 | v9.78,31.75 12.76,31.75 | 12.76,31.75 13.08,31.43 13.4,31.75 | JP20.1 13.08,31.75 | 18.1,31.75 18.41,31.43 18.73,31.75 | JP21.1 18.41,31.75 | 24.45,31.75 24.13,31.43 23.81,31.75 | JP22.1 24.13,31.62 24,31.75 | 31.43,31.75 31.75,31.43 32.07,31.75 | JP23.1 31.75,31.62 31.62,31.75 | 37.78,31.75 37.47,31.43 37.15,31.75 | JP24.1 37.47,31.75 | 43.18,31.5 43.43,31.75 | 43.18,31.43 42.86,31.75 | JP25.1 43.18,31.62 43.05,31.75 | 33.47,3.81 33.15,3.49 32.83,3.81 | JP33.1 33.15,3.68 33.02,3.81 | JP34.1 42.29,3.68 42.42,3.81 | v33.27,36.96 33.27,31.88 33.4,31.75 | R19.2 26.8,44.01 27.11,44.32 30.1,44.32 | v22.73,49.4 24.36,49.4 24.68,49.09 C1.1 24.68,48.07 24.99,47.62 29.78,47.62 30.1,47.43 30.1,44.64 | 30.1,44.01 29.78,44.32 30.1,44.64 | 30.1,44.01 v30.1,38.35 | 30.1,44.64 30.1,44.32 | 30.1,44.32 30.1,44.01 | 24.45,31.75 31.43,31.75 | 15.81,1.14 21.46,1.14 22.1,1.78 22.1,3.62 22.42,3.94 24.32,3.94
  Top 0.203: 15.81,1.14 15.62,1.14 | 15.62,1.14 15.49,1.14 | 15.49,1.14 15.18,1.14 | 15.18,1.14 8.19,1.14 | 8.19,1.14 7.87,1.14 | 7.87,1.14 7.56,1.14 7.87,1.46 8.19,1.14 | 15.81,1.14 15.49,1.46 15.18,1.14 | 15.49,1.27 15.62,1.14 | 15.49,2.86 15.49,10.35 15.18,10.67 13.78,10.67 13.46,10.99 13.46,16 14.35,16.89 v14.35,18.03 10.67,18.03 arc90 v10.54,17.91 | 15.49,2.86 15.49,2.54 | 15.49,2.54 15.49,2.22 | 15.49,2.22 15.49,1.14 | 15.49,2.86 15.81,2.54 15.49,2.22 | JP32.1 15.49,2.54 | JP31.1 7.87,1.14 | R20.2 24.96,5.36 24.64,5.04 24.64,3.94 | 24.96,3.94 24.64,3.94 | 24.64,3.94 24.32,3.94 | 24.96,3.94 24.64,4.25 24.32,3.94 | 33.47,3.81 33.78,3.81 34.42,3.17 35.18,3.17 35.81,3.81 41.97,3.81 | 14.8,31.75 14.48,31.43 14.16,31.75 | 43.43,31.75 45.91,31.75 46.23,32.07 46.23,38.42 46.55,38.73 48.58,38.73 48.9,39.05 JP26.1
  Bottom 0.203: SV1.3 2.8,31.75 C7.1 6.05,30.19 C5.2 7.49,30.44 | 7.49,30.44 8.57,30.44 8.89,30.76 8.89,31.43 9.21,31.75 v9.78,31.75 | 29.53,18.03 25.08,18.03 | 25.08,18.03 24.89,18.03 | 24.89,18.03 24.45,18.03 | 24.45,18.03 22.96,18.03 | 22.96,18.03 22.48,18.03 | 22.48,18.03 22.33,18.03 | 22.33,18.03 19.37,18.03 | 19.37,18.03 19.05,18.03 | 19.05,18.03 18.73,18.03 | 18.73,18.03 v14.35,18.03 | 29.53,18.03 29.84,18.03 | 29.84,18.03 30.16,18.03 | 30.16,18.03 40.32,18.03 | 40.32,18.03 40.64,18.03 | 40.64,18.03 40.96,18.03 40.64,18.35 40.32,18.03 | 7.49,30.44 7.11,30.82 v7.11,31.5 | 30.16,18.03 29.84,18.35 29.53,18.03 | JP29.1 29.84,18.03 | JP30.1 40.64,18.03 | 25.08,18.03 24.77,18.35 24.45,18.03 | v24.77,24.64 24.77,18.16 24.89,18.03 | 18.73,18.03 19.05,18.35 19.37,18.03 | JP28.1 19.05,18.03 | v33.27,36.96 30.42,36.96 30.1,37.27 v30.1,38.35 | v22.73,49.4 22.73,48.31 SR1.P$16 | SR2.P$16 22.88,12.06 22.57,12.38 22.57,14.91 C2.1 22.64,17.87 22.48,18.03 | v10.54,17.91 10.48,18.03 10.16,18.35 JP27.1 | 22.33,18.03 22.64,17.72 22.96,18.03
PP5V  (via drill 0.25)
  Top 0.203: 44.96,44.13 44.96,44.45 | 44.96,44.45 44.96,44.77 45.28,44.45 44.96,44.13 | v11.43,28.32 11.43,23.81 | 16.19,21.08 16.51,21.08 | 16.51,21.08 16.83,21.08 | 16.83,21.08 26.99,21.08 | 26.99,21.08 27.3,21.08 | 27.3,21.08 27.62,21.08 | 27.62,21.08 37.78,21.08 | 37.78,21.08 38.1,21.08 | 38.1,21.08 38.42,21.08 38.1,21.4 37.78,21.08 | v4.06,9.65 4.06,13.21 4.57,13.72 4.57,16.13 5.08,16.64 5.08,20.77 5.4,21.08 11.11,21.08 | v29.72,6.35 29.46,6.6 21.59,6.6 21.34,6.35 v21.34,4 | 7.75,23.5 7.3,23.5 7.62,23.18 7.94,23.5 | 7.75,23.5 7.94,23.5 | JP26.4 44.96,44.45 | JP27.4 7.62,23.37 7.75,23.5 | 11.43,23.81 11.11,23.5 11.43,23.18 | 11.43,23.81 11.43,23.37 | 11.43,23.37 11.43,23.18 | 7.94,23.5 11.3,23.5 11.43,23.37 | 16.19,21.08 16.51,21.4 16.83,21.08 | JP28.4 16.51,21.08 | 26.99,21.08 27.3,21.4 27.62,21.08 | JP29.4 27.3,21.08 | JP30.4 38.1,21.08 | JP19.4 1.91,44.77 2.22,44.45 7.18,44.45 7.49,44.13 v7.49,43.56 | 11.11,21.08 11.56,21.08 | 11.56,21.08 11.75,21.08 | 11.75,21.08 16.19,21.08 | 11.75,21.08 11.43,21.4 11.11,21.08 | 11.43,23.18 11.43,21.21 11.56,21.08 | v44.7,34.29 44.96,34.54 44.96,44.13
  Bottom 0.203: SV1.2 4.7,34.29 C3.1 7.07,34.8 C4.2 | C4.2 7.58,34.29 10.22,34.29 | 10.22,34.29 10.41,34.29 | 10.41,34.29 10.86,34.29 | 10.86,34.29 11.56,34.29 | 11.56,34.29 12.06,34.29 | 12.06,34.29 15.56,34.29 | 15.56,34.29 15.88,34.29 | 15.88,34.29 16.19,34.29 | 21.27,34.29 21.59,34.29 | 21.59,34.29 21.91,34.29 | 21.91,34.29 28.89,34.29 | 28.89,34.29 29.21,34.29 | 29.21,34.29 29.53,34.29 | 29.53,34.29 34.54,34.29 | 34.54,34.29 35.05,34.29 | 35.05,34.29 35.31,34.29 | 35.31,34.29 40.32,34.29 | 40.32,34.29 40.64,34.29 | 40.64,34.29 40.96,34.29 | 40.96,34.29 v44.7,34.29 | 35.31,34.29 34.92,33.91 34.54,34.29 | 39.43,6.35 39.75,6.35 | 39.75,6.35 40.07,6.35 39.75,6.03 39.43,6.35 | 40.96,34.29 40.64,33.97 40.32,34.29 | JP25.4 40.64,34.29 | JP24.4 34.92,34.16 35.05,34.29 | 29.53,34.29 29.21,33.97 28.89,34.29 | JP23.4 29.21,34.29 | 21.91,34.29 21.59,33.97 21.27,34.29 | JP22.4 21.59,34.29 | 16.19,34.29 15.88,33.97 15.56,34.29 | JP21.4 15.88,34.29 | 10.22,34.29 10.54,33.97 10.86,34.29 | JP20.4 10.54,34.16 10.41,34.29 | JP34.4 39.75,6.35 | 16.19,34.29 18.92,34.29 19.56,34.92 20.45,34.92 21.08,34.29 21.27,34.29 | 14.54,3.94 14.22,3.94 | 14.22,3.94 13.91,3.94 | 13.91,3.94 5.65,3.94 | 5.65,3.94 5.46,3.94 | 5.46,3.94 5.02,3.94 | v4.06,9.65 4.06,4.25 4.38,3.94 5.02,3.94 | 5.65,3.94 5.33,4.25 5.02,3.94 | JP31.4 5.33,4.06 5.46,3.94 | 14.54,3.94 14.22,4.25 13.91,3.94 | JP32.4 14.22,3.94 | 14.54,3.94 18.8,3.94 19.05,3.68 21.02,3.68 v21.34,4 | 39.43,6.35 30.92,6.35 | 30.92,6.35 30.61,6.35 | 30.61,6.35 30.29,6.35 | 30.29,6.35 v29.72,6.35 | 30.92,6.35 30.61,6.03 30.29,6.35 | JP33.4 30.61,6.35 | C4.2 7.49,34.63 v7.49,43.56 | v11.43,28.32 11.43,29.08 11.81,29.46 11.81,34.04 | 11.81,34.04 12.06,34.29
  Bottom 0.203: 11.81,34.04 11.56,34.29
PP12V  (via drill 0.25)
  Top 0.203: 8.7,37.59 6.35,37.59 5.71,38.1 v5.71,40.01 | 8.7,37.59 9.02,37.59 | 9.02,37.59 9.34,37.59 | 9.34,37.59 12.76,37.59 | 12.76,37.59 13.21,37.59 | 13.21,37.59 13.34,37.59 | 13.34,37.59 13.4,37.59 | 13.4,37.59 18.1,37.59 | 18.1,37.59 18.29,37.59 | 18.29,37.59 18.73,37.59 | 18.73,37.59 23.81,37.59 | 23.81,37.59 24,37.59 | 24,37.59 24.45,37.59 | 24.45,37.59 31.43,37.59 | 31.43,37.59 31.62,37.59 | 31.62,37.59 32.07,37.59 | 32.07,37.59 37.15,37.59 | 37.15,37.59 37.47,37.59 | 37.47,37.59 37.78,37.59 | 37.78,37.59 42.86,37.59 | 42.86,37.59 43.05,37.59 | 43.05,37.59 43.5,37.59 | 42.86,37.59 43.18,37.27 43.5,37.59 | JP25.5 43.18,37.47 43.05,37.59 | 37.78,37.59 37.47,37.27 37.15,37.59 | JP24.5 37.47,37.59 | 32.07,37.59 31.75,37.27 31.43,37.59 | JP23.5 31.75,37.47 31.62,37.59 | 24.45,37.59 24.13,37.27 23.81,37.59 | JP22.5 24.13,37.47 24,37.59 | 18.1,37.59 18.41,37.27 18.73,37.59 | JP21.5 18.41,37.47 18.29,37.59 | v31.88,9.4 22.23,9.4 21.84,9.02 v21.21,9.02 | 13.4,37.59 13.08,37.27 12.76,37.59 | 13.08,37.34 13.34,37.59 | JP20.5 13.08,37.47 13.21,37.59 | 8.7,37.59 9.02,37.27 9.34,37.59 | v9.02,27.3 9.02,37.59 | v44.2,37.59 43.5,37.59
  Bottom 0.203: SV1.1 4.23,36.83 C6.2 4.87,39.08 C8.1 4.07,40.32 4.38,40.64 4.38,40.83 4.7,41.15 4.89,41.15 | JP19.5 3.81,48.26 3.17,47.62 3.17,42.55 3.68,42.04 4.89,42.04 5.21,41.72 5.21,41.15 | 47.62,46.67 47.62,38.67 47.31,38.35 44.51,38.35 44.2,38.04 v44.2,37.59 | 47.62,46.67 47.62,46.99 | 47.62,46.99 47.62,47.31 47.94,46.99 47.62,46.67 | v5.71,40.01 5.71,40.89 5.46,41.15 | v9.02,27.3 9.84,27.3 | 9.84,27.3 10.16,27.3 | 10.16,27.3 10.48,27.3 | 32.83,9.4 33.15,9.4 | 33.15,9.4 33.47,9.4 | 33.47,9.4 41.97,9.4 | 41.97,9.4 42.29,9.4 | 42.29,9.4 42.61,9.4 42.29,9.08 41.97,9.4 | 10.98,27.3 11.3,27.3 | 11.3,27.3 11.62,27.3 | 11.62,27.3 18.73,27.3 | 18.73,27.3 19.18,27.3 | 19.18,27.3 19.37,27.3 | 19.37,27.3 29.53,27.3 | 29.53,27.3 29.84,27.3 | 29.84,27.3 30.16,27.3 | 30.16,27.3 40.32,27.3 | 40.32,27.3 40.64,27.3 | 40.64,27.3 40.96,27.3 40.64,26.99 40.32,27.3 | JP30.5 40.64,27.3 | 30.16,27.3 29.84,26.99 29.53,27.3 | JP29.5 29.84,27.3 | 18.73,27.3 19.05,26.99 19.37,27.3 | JP28.5 19.05,27.18 19.18,27.3 | 10.48,27.3 10.16,26.99 9.84,27.3 | JP27.5 10.16,27.3 | JP26.5 47.62,46.99 | 32.83,9.4 33.15,9.08 33.47,9.4 | JP33.5 33.15,9.4 | JP34.5 42.29,9.4 | 17.08,8.76 20.45,8.76 20.7,9.02 v21.21,9.02 | 17.08,8.76 16.76,8.45 16.45,8.76 | 17.08,8.76 16.76,8.76 | 16.76,8.76 16.45,8.76 | 16.45,8.76 8.19,8.76 | 8.19,8.76 8,8.76 | 8,8.76 7.56,8.76 | 7.56,8.76 5.4,8.76 5.08,9.08 5.08,13.34 5.84,14.22 10.98,14.22 11.3,14.54 11.3,14.74 | 8.19,8.76 7.87,8.45 7.56,8.76 | JP31.5 7.87,8.64 8,8.76 | JP32.5 16.76,8.76 | 11.3,14.61 11.3,14.74 | 10.98,27.3 11.3,26.99 11.62,27.3 | 10.98,27.3 10.48,27.3 | 11.3,14.74 11.3,27.3 | v31.88,9.4 32.83,9.4 | 4.89,41.15 5.21,41.15 | 5.21,41.15 5.46,41.15
  Bottom 0.203: 5.21,41.4 5.46,41.15 | 5.21,41.47 4.89,41.15
SERIES_CONNECT  (via drill 0.25)
  Top 0.203: v27.56,35.05 v27.56,33.66 | v27.56,29.59 27.56,26.73 27.88,26.42 v30.54,26.42 | v21.72,10.1 v21.72,11.56 | v21.72,17.34 21.72,17.59 22.04,17.91 30.67,17.91 30.99,18.22 v30.99,18.67
  Bottom 0.203: SR1.P$9 22.48,39.17 22.48,38.42 22.8,38.1 27.24,38.1 27.56,37.78 v27.56,35.05 | v27.56,33.66 v27.56,29.59 | v21.72,10.1 22.04,9.53 SR2.P$14 | v21.72,11.56 v21.72,17.34 | v30.54,26.42 30.99,25.97 v30.99,18.67
SHIFT_CLK  (via drill 0.25)
  Top 0.203: v26.92,28.07 v26.92,26.67 | v20.57,18.67 20.19,18.29 v20.19,17.4 | v26.92,36.07 v26.92,32.38 | v18.29,5.84 18.16,5.97 18.16,11.68 18.54,12.06 v18.54,15.88 | v13.59,17.27 13.46,17.14 9.91,17.14 9.65,17.91 v5.97,17.91
  Bottom 0.203: SR1.P$11 21.59,41.91 20.45,40.77 20.45,36.96 20.57,36.7 24.77,36.7 25.4,36.07 v26.92,36.07 | v26.92,32.38 v26.92,28.07 | v26.92,26.67 26.54,26.29 23.88,26.29 23.62,26.04 23.62,18.92 23.24,18.67 v20.57,18.67 | SV1.8 5.71,19.05 5.97,18.8 v5.97,17.91 | SR2.P$11 21.59,5.71 21.34,5.97 19.05,5.97 18.92,5.84 v18.29,5.84 | v20.19,17.4 20.07,17.27 18.54,17.27 | 18.54,17.27 v13.59,17.27 | v18.54,15.88 18.54,17.27

### Text on the board
tPlace: Sukhman Marok / Gabriel Maraboto / IGVC Apollo v1.0 / Cal Poly, SLO / February 6, 2016